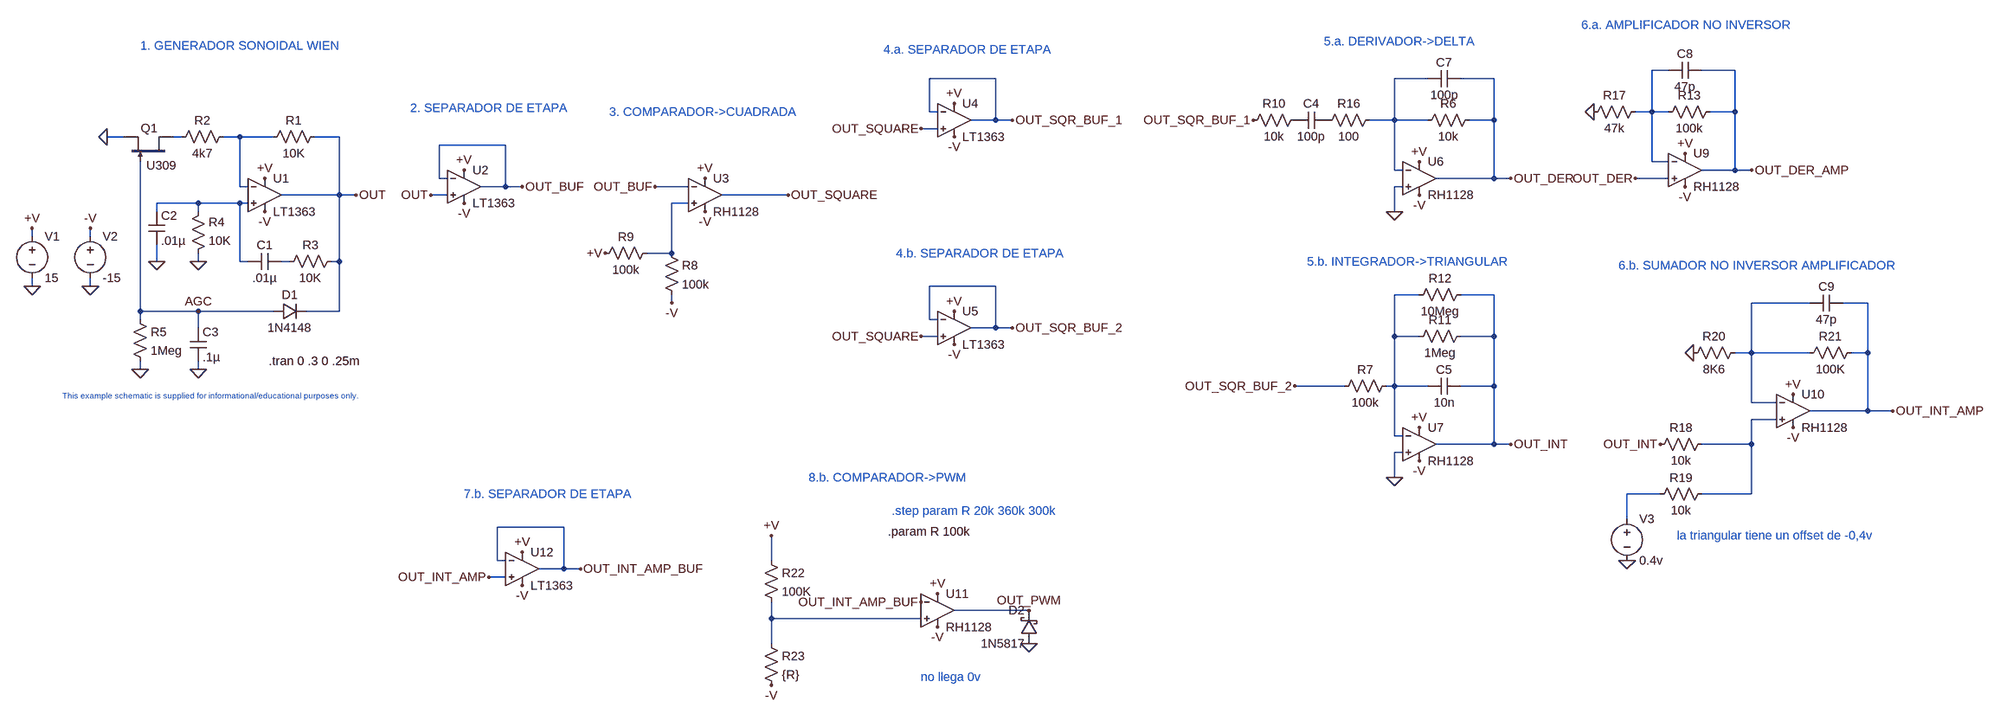
[diagram p0: schematic Wien_comp_der_int.asc]
Wien_comp_der_int.asc, the LTspice schematic file:
Version 4
SHEET 1 3132 1296
WIRE 2512 -48 2480 -48
WIRE 2640 -48 2576 -48
WIRE 1216 -32 1088 -32
WIRE 2048 -32 1984 -32
WIRE 2176 -32 2112 -32
WIRE 1088 32 1088 -32
WIRE 1104 32 1088 32
WIRE 2480 32 2480 -48
WIRE 2480 32 2448 32
WIRE 2512 32 2480 32
WIRE 2640 32 2640 -48
WIRE 2640 32 2592 32
WIRE 1216 48 1216 -32
WIRE 1216 48 1168 48
WIRE 1248 48 1216 48
WIRE 1984 48 1984 -32
WIRE 1984 48 1936 48
WIRE 2048 48 1984 48
WIRE 2176 48 2176 -32
WIRE 2176 48 2128 48
WIRE 1104 64 1072 64
WIRE -464 80 -496 80
WIRE -352 80 -368 80
WIRE -240 80 -272 80
WIRE -176 80 -240 80
WIRE -48 80 -96 80
WIRE 272 96 144 96
WIRE 2480 128 2480 32
WIRE 2512 128 2480 128
WIRE 1984 144 1984 48
WIRE 2000 144 1984 144
WIRE 2640 144 2640 32
WIRE 2640 144 2576 144
WIRE 2672 144 2640 144
WIRE 144 160 144 96
WIRE 160 160 144 160
WIRE 2176 160 2176 48
WIRE 2176 160 2064 160
WIRE 2208 160 2176 160
WIRE 2512 160 2448 160
WIRE -240 176 -240 80
WIRE -224 176 -240 176
WIRE 272 176 272 96
WIRE 272 176 224 176
WIRE 304 176 272 176
WIRE 624 176 560 176
WIRE 2000 176 1984 176
WIRE -48 192 -48 80
WIRE -48 192 -160 192
WIRE -16 192 -48 192
WIRE 160 192 128 192
WIRE 816 192 688 192
WIRE -320 208 -400 208
WIRE -240 208 -320 208
WIRE -224 208 -240 208
WIRE 624 208 592 208
WIRE -400 224 -400 208
WIRE -320 224 -320 208
WIRE 1984 224 1984 176
WIRE -640 272 -640 256
WIRE -528 272 -528 256
WIRE 592 304 592 208
WIRE 592 304 544 304
WIRE -400 320 -400 288
WIRE -320 320 -320 304
WIRE -240 320 -240 208
WIRE -224 320 -240 320
WIRE -144 320 -160 320
WIRE -48 320 -48 192
WIRE -48 320 -64 320
WIRE -640 368 -640 352
WIRE -528 368 -528 352
WIRE 1216 368 1088 368
WIRE 2032 384 1984 384
WIRE 2176 384 2112 384
WIRE 592 400 592 384
WIRE 2784 400 2672 400
WIRE 2896 400 2848 400
WIRE -432 416 -432 128
WIRE -320 416 -432 416
WIRE -176 416 -320 416
WIRE -48 416 -48 320
WIRE -48 416 -112 416
WIRE -432 432 -432 416
WIRE 1088 432 1088 368
WIRE 1104 432 1088 432
WIRE -320 448 -320 416
WIRE 1216 448 1216 368
WIRE 1216 448 1168 448
WIRE 1248 448 1216 448
WIRE 1104 464 1072 464
WIRE 1984 464 1984 384
WIRE 2032 464 1984 464
WIRE 2176 464 2176 384
WIRE 2176 464 2112 464
WIRE 2672 496 2672 400
WIRE 2672 496 2640 496
WIRE 2784 496 2672 496
WIRE 2896 496 2896 400
WIRE 2896 496 2864 496
WIRE -432 528 -432 512
WIRE -320 528 -320 512
WIRE 1888 560 1792 560
WIRE 1984 560 1984 464
WIRE 1984 560 1968 560
WIRE 2048 560 1984 560
WIRE 2176 560 2176 464
WIRE 2176 560 2112 560
WIRE 2672 592 2672 496
WIRE 2720 592 2672 592
WIRE 2896 608 2896 496
WIRE 2896 608 2784 608
WIRE 2944 608 2896 608
WIRE 2720 624 2672 624
WIRE 1984 656 1984 560
WIRE 2000 656 1984 656
WIRE 2176 672 2176 560
WIRE 2176 672 2064 672
WIRE 2208 672 2176 672
WIRE 2672 672 2672 624
WIRE 2672 672 2576 672
WIRE 2000 688 1984 688
WIRE 1984 736 1984 688
WIRE 2496 768 2432 768
WIRE 2672 768 2672 672
WIRE 2672 768 2576 768
WIRE 2432 816 2432 768
WIRE 384 832 256 832
WIRE 256 896 256 832
WIRE 272 896 256 896
WIRE 784 896 784 848
WIRE 384 912 384 832
WIRE 384 912 336 912
WIRE 416 912 384 912
WIRE 272 928 240 928
WIRE 1280 992 1136 992
WIRE 784 1008 784 976
WIRE 1072 1008 784 1008
WIRE 784 1056 784 1008
FLAG -192 160 +V
FLAG -192 224 -V
FLAG -640 256 +V
FLAG -528 368 0
FLAG -640 368 0
FLAG -528 256 -V
FLAG -320 320 0
FLAG -400 320 0
FLAG -496 80 0
FLAG -320 528 0
FLAG -432 528 0
FLAG -16 192 OUT
FLAG -320 416 AGC
FLAG 2032 128 +V
FLAG 2032 192 -V
FLAG 2208 160 OUT_DER
FLAG 1984 224 0
FLAG 192 208 -V
FLAG 192 144 +V
FLAG 128 192 OUT
FLAG 560 176 OUT_BUF
FLAG 2032 640 +V
FLAG 2032 704 -V
FLAG 2208 672 OUT_INT
FLAG 304 176 OUT_BUF
FLAG 656 160 +V
FLAG 656 224 -V
FLAG 1136 80 -V
FLAG 1136 16 +V
FLAG 1136 480 -V
FLAG 1136 416 +V
FLAG 1248 48 OUT_SQR_BUF_1
FLAG 1248 448 OUT_SQR_BUF_2
FLAG 2944 608 OUT_INT_AMP
FLAG 464 304 +V
FLAG 592 400 -V
FLAG 2544 112 +V
FLAG 2544 176 -V
FLAG 2368 32 0
FLAG 2448 160 OUT_DER
FLAG 2672 144 OUT_DER_AMP
FLAG 1984 736 0
FLAG 2496 672 OUT_INT
FLAG 2752 576 +V
FLAG 2752 640 -V
FLAG 2432 896 0
FLAG 2560 496 0
FLAG 816 192 OUT_SQUARE
FLAG 1072 64 OUT_SQUARE
FLAG 1072 464 OUT_SQUARE
FLAG 1712 48 OUT_SQR_BUF_1
FLAG 1792 560 OUT_SQR_BUF_2
FLAG 784 848 +V
FLAG 1104 960 +V
FLAG 304 944 -V
FLAG 304 880 +V
FLAG 240 928 OUT_INT_AMP
FLAG 416 912 OUT_INT_AMP_BUF
FLAG 1072 976 OUT_INT_AMP_BUF
FLAG 1280 992 OUT_PWM
FLAG 784 1136 -V
FLAG 1104 1024 -V
FLAG 1280 1056 0
SYMBOL voltage -640 256 R0
SYMATTR InstName V1
SYMATTR Value 15
SYMBOL voltage -528 256 R0
SYMATTR InstName V2
SYMATTR Value -15
SYMBOL res -80 64 R90
WINDOW 0 0 56 VBottom 2
WINDOW 3 32 56 VTop 2
SYMATTR InstName R1
SYMATTR Value 10K
SYMBOL res -256 64 R90
WINDOW 0 0 56 VBottom 2
WINDOW 3 32 56 VTop 2
SYMATTR InstName R2
SYMATTR Value 4k7
SYMBOL res -48 304 R90
WINDOW 0 0 56 VBottom 2
WINDOW 3 32 56 VTop 2
SYMATTR InstName R3
SYMATTR Value 10K
SYMBOL res -336 320 M180
WINDOW 0 36 76 Left 2
WINDOW 3 36 40 Left 2
SYMATTR InstName R4
SYMATTR Value 10K
SYMBOL cap -160 304 R90
WINDOW 0 0 32 VBottom 2
WINDOW 3 32 32 VTop 2
SYMATTR InstName C1
SYMATTR Value .01µ
SYMBOL cap -416 224 R0
SYMATTR InstName C2
SYMATTR Value .01µ
SYMBOL njf -368 128 M270
WINDOW 0 49 47 VTop 2
WINDOW 3 -7 52 VLeft 2
SYMATTR InstName Q1
SYMATTR Value U309
SYMBOL diode -176 400 M90
WINDOW 0 0 32 VBottom 2
WINDOW 3 32 32 VTop 2
SYMATTR InstName D1
SYMATTR Value 1N4148
SYMBOL res -448 416 R0
SYMATTR InstName R5
SYMATTR Value 1Meg
SYMBOL cap -336 512 M180
WINDOW 0 24 56 Left 2
WINDOW 3 24 8 Left 2
SYMATTR InstName C3
SYMATTR Value .1µ
SYMBOL res 2144 32 R90
WINDOW 0 0 56 VBottom 2
WINDOW 3 32 56 VTop 2
SYMATTR InstName R6
SYMATTR Value 10k
SYMBOL cap 1856 32 R90
WINDOW 0 0 32 VBottom 2
WINDOW 3 32 32 VTop 2
SYMATTR InstName C4
SYMATTR Value 100p
SYMBOL res 1984 544 R90
WINDOW 0 0 56 VBottom 2
WINDOW 3 32 56 VTop 2
SYMATTR InstName R7
SYMATTR Value 100k
SYMBOL cap 2112 544 R90
WINDOW 0 0 32 VBottom 2
WINDOW 3 32 32 VTop 2
SYMATTR InstName C5
SYMATTR Value 10n
SYMBOL res 1808 32 R90
WINDOW 0 0 56 VBottom 2
WINDOW 3 32 56 VTop 2
SYMATTR InstName R10
SYMATTR Value 10k
SYMBOL res 2128 448 R90
WINDOW 0 0 56 VBottom 2
WINDOW 3 32 56 VTop 2
SYMATTR InstName R11
SYMATTR Value 1Meg
SYMBOL OpAmps\\LT1363 -192 128 R0
SYMATTR InstName U1
SYMBOL OpAmps\\LT1363 192 112 R0
SYMATTR InstName U2
SYMBOL OpAmps\\LT1363 1136 -16 R0
SYMATTR InstName U4
SYMBOL OpAmps\\LT1363 1136 384 R0
SYMATTR InstName U5
SYMBOL OpAmps\\RH1128 2032 608 R0
SYMATTR InstName U7
SYMBOL OpAmps\\RH1128 2032 96 R0
SYMATTR InstName U6
SYMBOL res 576 288 R0
SYMATTR InstName R8
SYMATTR Value 100k
SYMBOL res 560 288 R90
WINDOW 0 0 56 VBottom 2
WINDOW 3 32 56 VTop 2
SYMATTR InstName R9
SYMATTR Value 100k
SYMBOL OpAmps\\RH1128 656 128 R0
SYMATTR InstName U3
SYMBOL res 1952 32 R90
WINDOW 0 0 56 VBottom 2
WINDOW 3 32 56 VTop 2
SYMATTR InstName R16
SYMATTR Value 100
SYMBOL cap 2112 -48 R90
WINDOW 0 0 32 VBottom 2
WINDOW 3 32 32 VTop 2
SYMATTR InstName C7
SYMATTR Value 100p
SYMBOL res 2128 368 R90
WINDOW 0 0 56 VBottom 2
WINDOW 3 32 56 VTop 2
SYMATTR InstName R12
SYMATTR Value 10Meg
SYMBOL res 2608 16 R90
WINDOW 0 0 56 VBottom 2
WINDOW 3 32 56 VTop 2
SYMATTR InstName R13
SYMATTR Value 100k
SYMBOL res 2464 16 R90
WINDOW 0 0 56 VBottom 2
WINDOW 3 32 56 VTop 2
SYMATTR InstName R17
SYMATTR Value 47k
SYMBOL OpAmps\\RH1128 2544 80 R0
SYMATTR InstName U9
SYMBOL cap 2576 -64 R90
WINDOW 0 0 32 VBottom 2
WINDOW 3 32 32 VTop 2
SYMATTR InstName C8
SYMATTR Value 47p
SYMBOL OpAmps\\RH1128 2752 544 R0
SYMATTR InstName U10
SYMBOL res 2592 656 R90
WINDOW 0 0 56 VBottom 2
WINDOW 3 32 56 VTop 2
SYMATTR InstName R18
SYMATTR Value 10k
SYMBOL res 2592 752 R90
WINDOW 0 0 56 VBottom 2
WINDOW 3 32 56 VTop 2
SYMATTR InstName R19
SYMATTR Value 10k
SYMBOL voltage 2432 800 R0
WINDOW 123 0 0 Left 0
WINDOW 39 0 0 Left 0
SYMATTR InstName V3
SYMATTR Value 0.4v
SYMBOL res 2656 480 R90
WINDOW 0 0 56 VBottom 2
WINDOW 3 32 56 VTop 2
SYMATTR InstName R20
SYMATTR Value 8K6
SYMBOL res 2880 480 R90
WINDOW 0 0 56 VBottom 2
WINDOW 3 32 56 VTop 2
SYMATTR InstName R21
SYMATTR Value 100K
SYMBOL cap 2848 384 R90
WINDOW 0 0 32 VBottom 2
WINDOW 3 32 32 VTop 2
SYMATTR InstName C9
SYMATTR Value 47p
SYMBOL OpAmps\\RH1128 1104 928 R0
SYMATTR InstName U11
SYMBOL res 768 880 R0
SYMATTR InstName R22
SYMATTR Value 100K
SYMBOL res 768 1040 R0
SYMATTR InstName R23
SYMATTR Value {R}
SYMBOL OpAmps\\LT1363 304 848 R0
SYMATTR InstName U12
SYMBOL schottky 1296 1056 R180
WINDOW 0 24 64 Left 2
WINDOW 3 24 0 Left 2
SYMATTR InstName D2
SYMATTR Value 1N5817
SYMATTR Description Diode
SYMATTR Type diode
TEXT -184 512 Left 2 !.tran 0 .3 0 .25m
TEXT -296 568 Top 1 ;This example schematic is supplied for informational/educational purposes only.
TEXT -432 -96 Left 2 ;1. GENERADOR SONOIDAL WIEN
TEXT 472 32 Left 2 ;3. COMPARADOR->CUADRADA
TEXT 1000 -88 Left 2 ;4.a. SEPARADOR DE ETAPA
TEXT 1848 -104 Left 2 ;5.a. DERIVADOR->DELTA
TEXT 1816 320 Left 2 ;5.b. INTEGRADOR->TRIANGULAR
TEXT 88 24 Left 2 ;2. SEPARADOR DE ETAPA
TEXT 1024 304 Left 2 ;4.b. SEPARADOR DE ETAPA
TEXT 2344 -136 Left 2 ;6.a. AMPLIFICADOR NO INVERSOR
TEXT 2416 328 Left 2 ;6.b. SUMADOR NO INVERSOR AMPLIFICADOR
TEXT 192 768 Left 2 ;7.b. SEPARADOR DE ETAPA
TEXT 1016 800 Left 2 ;.step param R 20k 360k 300k
TEXT 856 736 Left 2 ;8.b. COMPARADOR->PWM
TEXT 2528 848 Left 2 ;la triangular tiene un offset de -0,4v
TEXT 1072 1120 Left 2 ;no llega 0v
TEXT 1008 840 Left 2 !.param R 100k

The netlist it stands for:
* Wien_comp_der_int.asc
V1 +V 0 15
V2 -V 0 -15
R1 OUT N004 10K
R2 N004 N003 4k7
R3 OUT N007 10K
R4 0 N005 10K
C1 N007 N005 .01µ
C2 N005 0 .01µ
J§Q1 N003 AGC 0 U309
D1 AGC OUT 1N4148
R5 AGC 0 1Meg
C3 0 AGC .1µ
R6 OUT_DER N002 10k
C4 P001 P002 100p
R7 N008 OUT_SQR_BUF_2 100k
C5 OUT_INT N008 10n
R10 P002 OUT_SQR_BUF_1 10k
R11 OUT_INT N008 1Meg
XU1 N005 N004 +V -V OUT LT1363  ; pins In+ In- V+ V- OUT
XU2 OUT OUT_BUF +V -V OUT_BUF LT1363  ; pins In+ In- V+ V- OUT
XU4 OUT_SQUARE OUT_SQR_BUF_1 +V -V OUT_SQR_BUF_1 LT1363  ; pins In+ In- V+ V- OUT
XU5 OUT_SQUARE OUT_SQR_BUF_2 +V -V OUT_SQR_BUF_2 LT1363  ; pins In+ In- V+ V- OUT
XU7 0 N008 +V -V OUT_INT RH1128  ; pins In+ In- V+ V- OUT
XU6 0 N002 +V -V OUT_DER RH1128  ; pins In+ In- V+ V- OUT
R8 N006 -V 100k
R9 N006 +V 100k
XU3 N006 OUT_BUF +V -V OUT_SQUARE RH1128  ; pins In+ In- V+ V- OUT
R16 N002 P001 100
C7 OUT_DER N002 100p
R12 OUT_INT N008 10Meg
R13 OUT_DER_AMP N001 100k
R17 N001 0 47k
XU9 OUT_DER N001 +V -V OUT_DER_AMP RH1128  ; pins In+ In- V+ V- OUT
C8 OUT_DER_AMP N001 47p
XU10 N010 N009 +V -V OUT_INT_AMP RH1128  ; pins In+ In- V+ V- OUT
R18 N010 OUT_INT 10k
R19 N010 N011 10k
V3 N011 0 0.4v
R20 N009 0 8K6
R21 OUT_INT_AMP N009 100K
C9 OUT_INT_AMP N009 47p
XU11 N012 OUT_INT_AMP_BUF +V -V OUT_PWM RH1128  ; pins In+ In- V+ V- OUT
R22 +V N012 100K
R23 N012 -V {R}
XU12 OUT_INT_AMP OUT_INT_AMP_BUF +V -V OUT_INT_AMP_BUF LT1363  ; pins In+ In- V+ V- OUT
D2 0 OUT_PWM 1N5817
.model D D
.lib standard.dio
.model NJF NJF
.model PJF PJF
.lib standard.jft
.tran 0 .3 0 .25m
* This example schematic is supplied for informational/educational purposes only.
* 1. GENERADOR SONOIDAL WIEN
* 3. COMPARADOR->CUADRADA
* 4.a. SEPARADOR DE ETAPA
* 5.a. DERIVADOR->DELTA
* 5.b. INTEGRADOR->TRIANGULAR
* 2. SEPARADOR DE ETAPA
* 4.b. SEPARADOR DE ETAPA
* 6.a. AMPLIFICADOR NO INVERSOR
* 6.b. SUMADOR NO INVERSOR AMPLIFICADOR
* 7.b. SEPARADOR DE ETAPA
* .step param R 20k 360k 300k
* 8.b. COMPARADOR->PWM
* la triangular tiene un offset de -0,4v
* no llega 0v
.param R 100k
.lib LT1363.sub
.backanno
.end